# Altium schematic sheet 06.SchDoc
size 420 x 297 mm
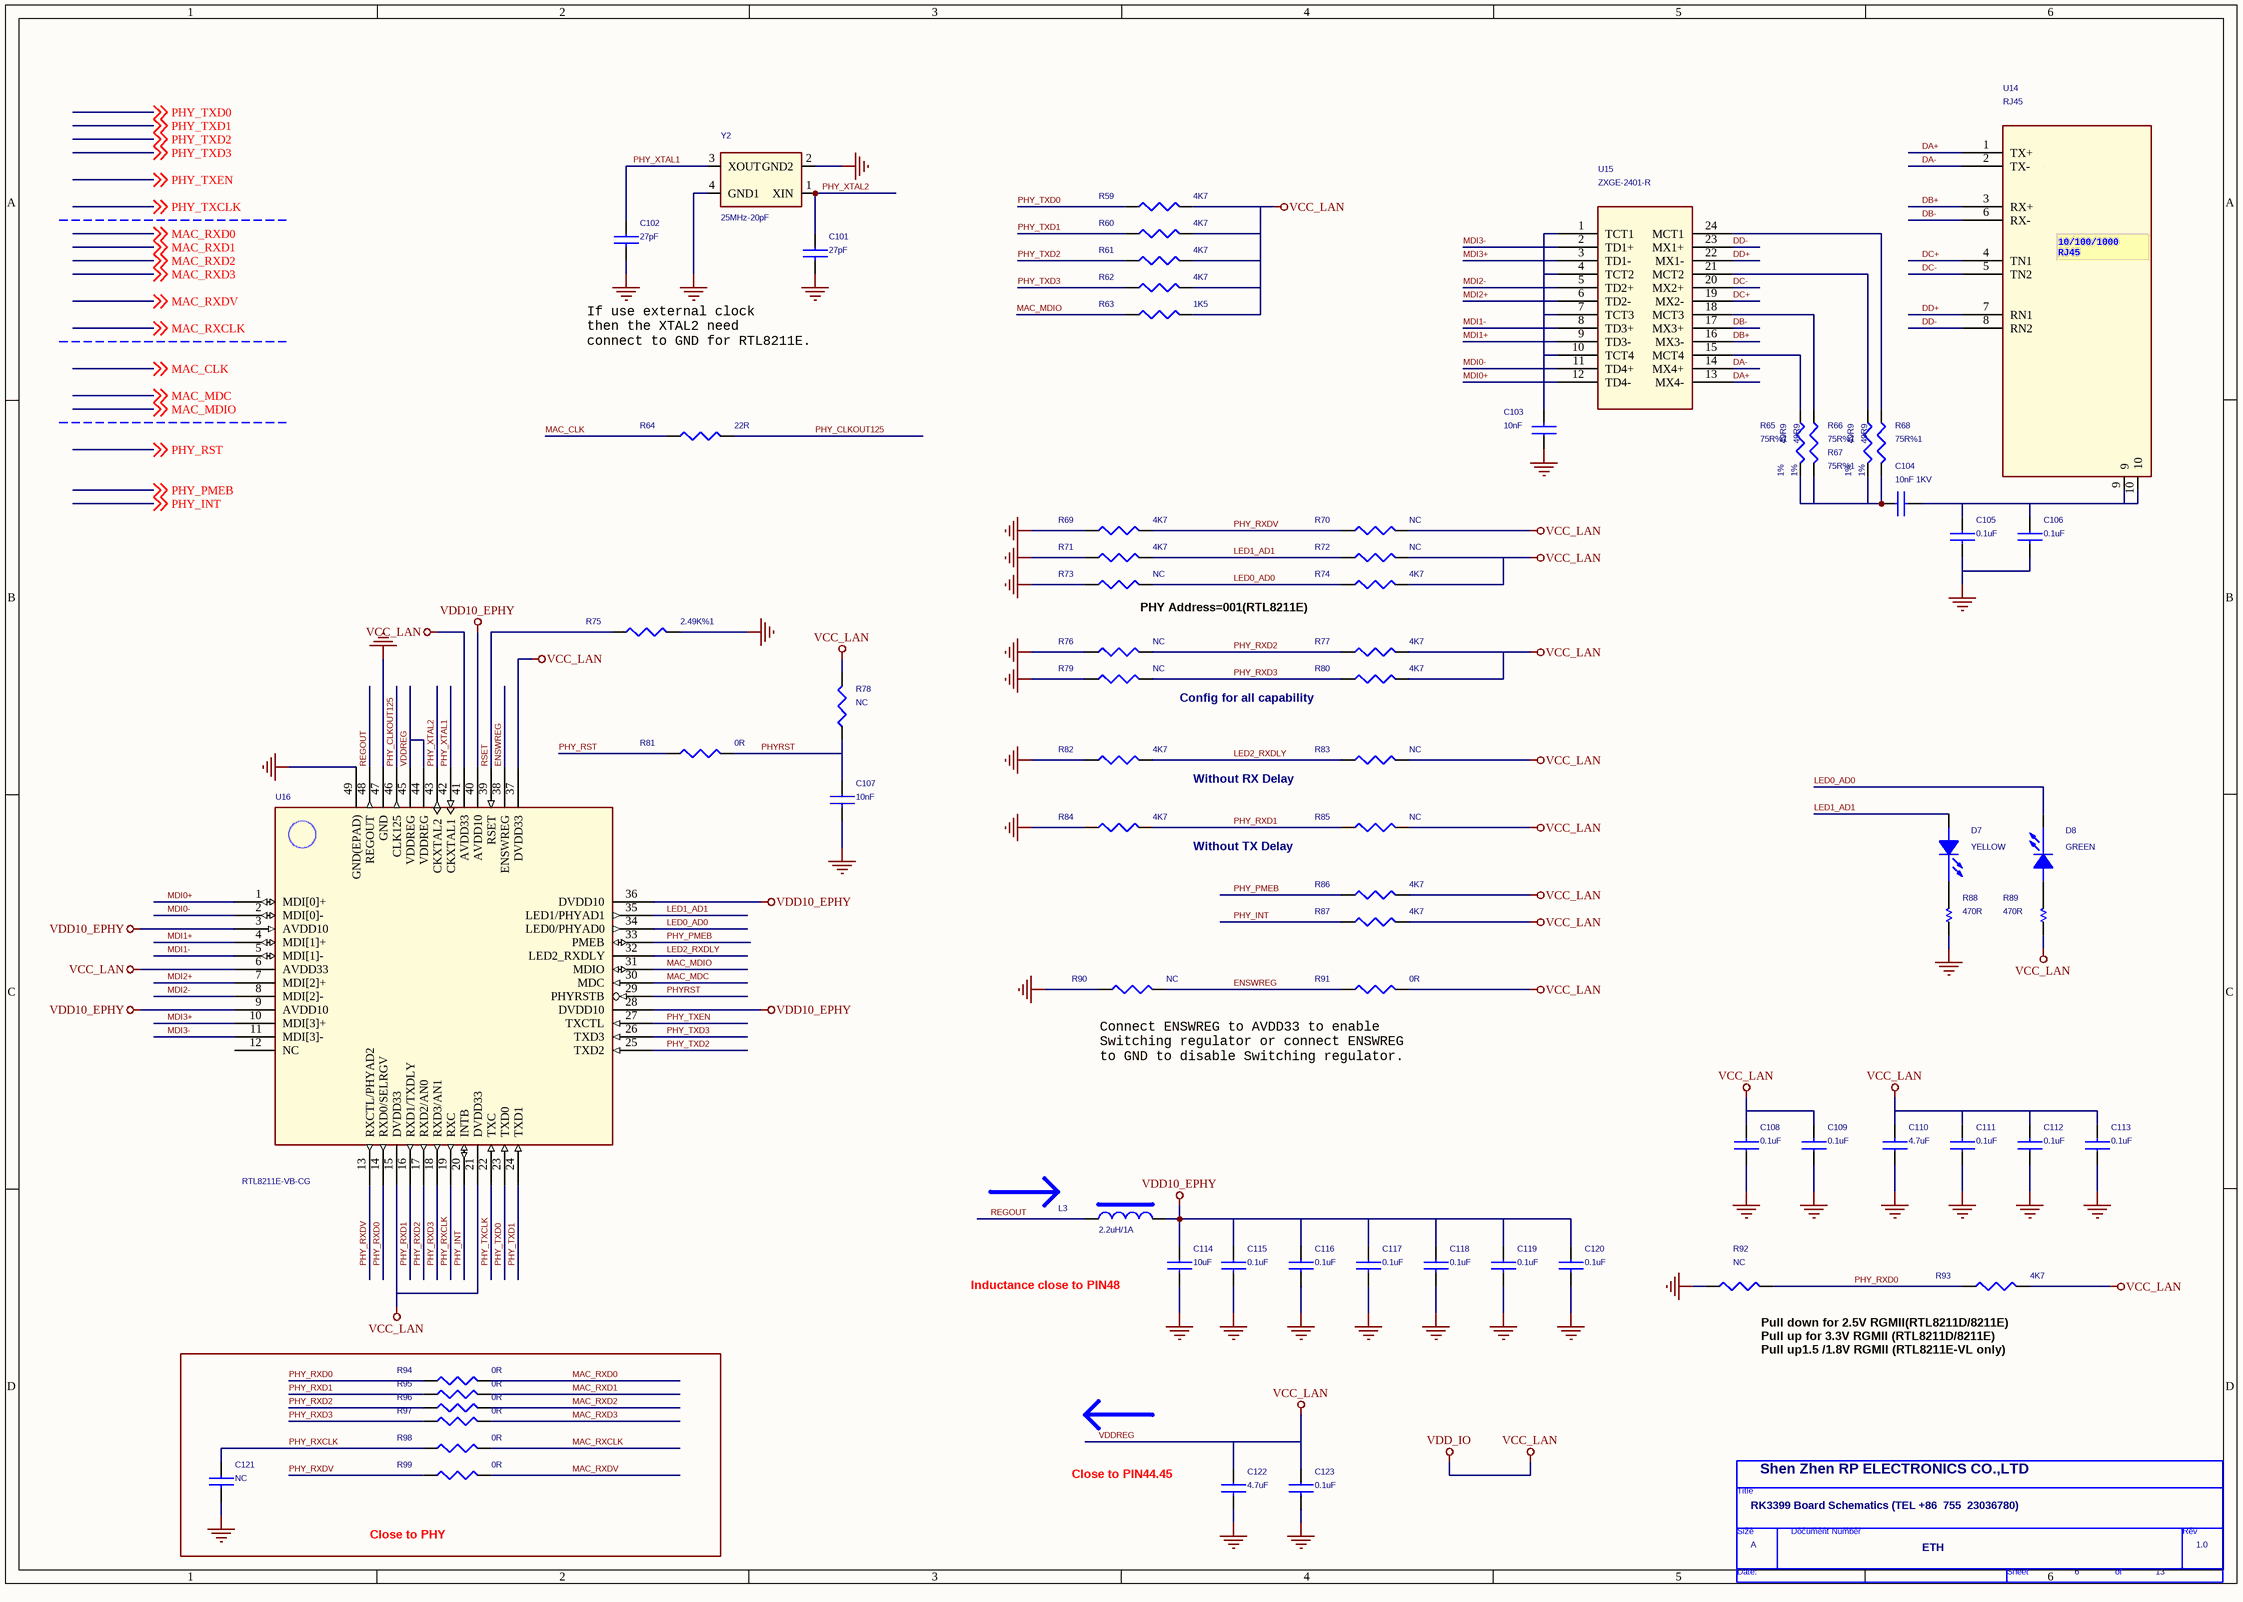
[diagram p0: 06.SchDoc]

## Parts
*  Doc: ETH  RevCode: 1.0  Title: RK3399 Board Schematics (TEL +86  755  23036780)  Page Size: A  Page Number: 6  Page Count: 13  Cage Code: Shen Zhen RP ELECTRONICS CO.,LTD  (hidden comment: TitleBlock0)  (graphical)
C101  27pF  [0402_cc]
C102  27pF  [0402_cc]
C103  10nF  [0402_cc]
C104  10nF 1KV  [C1206]
C105  0.1uF  [0402_cc]
C106  0.1uF  [0402_cc]
C107  10nF  [0402_cc]
C108  0.1uF  [0402_cc]
C109  0.1uF  [0402_cc]
C110  4.7uF  [0402_cc]
C111  0.1uF  [0402_cc]
C112  0.1uF  [0402_cc]
C113  0.1uF  [0402_cc]
C114  10uF  [0603_cc]
C115  0.1uF  [0402_cc]
C116  0.1uF  [0402_cc]
C117  0.1uF  [0402_cc]
C118  0.1uF  [0402_cc]
C119  0.1uF  [0402_cc]
C120  0.1uF  [0402_cc]
C121  NC  [0402_cc]
C122  4.7uF  [0402_cc]
C123  0.1uF  [0402_cc]
D7  YELLOW  [LED0805]
D8  GREEN  [LED0805]
L3  2.2uH/1A  [IND2520]
R59  4K7  [R0402]
R60  4K7  [R0402]
R61  4K7  [R0402]
R62  4K7  [R0402]
R63  1K5  [R0402]
R64  22R  [R0402]
R65  75R%1  TOL: 1%  VAL: 49R9  [R0805]
R66  75R%1  TOL: 1%  VAL: 49R9  [R0805]
R67  75R%1  TOL: 1%  VAL: 49R9  [R0805]
R68  75R%1  TOL: 1%  VAL: 49R9  [R0805]
R69  4K7  [R0402]
R70  NC  [R0402]
R71  4K7  [R0402]
R72  NC  [R0402]
R73  NC  [R0402]
R74  4K7  [R0402]
R75  2.49K%1  [R0402]
R76  NC  [R0402]
R77  4K7  [R0402]
R78  NC  [0603R]
R79  NC  [R0402]
R80  4K7  [R0402]
R81  0R  [R0402]
R82  4K7  [R0402]
R83  NC  [R0402]
R84  4K7  [R0402]
R85  NC  [R0402]
R86  4K7  [R0402]
R87  4K7  [R0402]
R88  470R  [0402_cc]
R89  470R  [0402_cc]
R90  NC  [R0402]
R91  0R  [R0402]
R92  NC  [R0402]
R93  4K7  [R0402]
R94  0R  [R0402]
R95  0R  [R0402]
R96  0R  [R0402]
R97  0R  [R0402]
R98  0R  [R0402]
R99  0R  [R0402]
U14  RJ45  [RJ45-881-810]
U15  ZXGE-2401-R  [ZXGE-2401-R]
U16  RTL8211E-VB-CG  [QFN48-6X6]
Y2  25MHz-20pF  [CRY-3225]

## Blocks framed on the sheet
Close to PHY: C121 R94-R99

## Nets
GND: C101.2 C102.2 C103.1 C105.2 C106.2 C107.2 C108.1 C109.1 C110.1 C111.1 C112.1 C113.1 C114.2 C115.2 C116.2 C117.2 C118.2 C119.2 C120.2 C121.2 C122.2 C123.2 R69.1 R71.1 R73.1 R75.2 R76.1 R79.1 R82.1 R84.1 R88.1 R90.1 R92.1 U16.47(GND) U16.49(GND(EPAD)) Y2.2(GND2) Y2.4(GND1)
VDD10_EPHY: C114.1 C115.1 C116.1 C117.1 C118.1 C119.1 C120.1 L3.2 U16.3(AVDD10) U16.9(AVDD10) U16.28(DVDD10) U16.36(DVDD10) U16.40(AVDD10)
VDDREG: C108.2 C109.2 C110.2 C111.2 C112.2 C113.2 C122.1 C123.1 R59.2 R60.2 R61.2 R62.2 R63.2 R70.2 R72.2 R74.2 R77.2 R78.2 R80.2 R83.2 R85.2 R86.2 R87.2 R89.1 R91.2 R93.2 U16.6(AVDD33) U16.15(DVDD33) U16.21(DVDD33) U16.37(DVDD33) U16.41(AVDD33) U16.44(VDDREG) U16.45(VDDREG)  [also labelled VCC_LAN, VDD_IO]
DA+: U14.1(TX+) U15.13(MX4-)
DA-: U14.2(TX-) U15.14(MX4+)
DB+: U14.3(RX+) U15.16(MX3-)
DB-: U14.6(RX-) U15.17(MX3+)
DC+: U14.4(TN1) U15.19(MX2-)
DC-: U14.5(TN2) U15.20(MX2+)
DD+: U14.7(RN1) U15.22(MX1-)
DD-: U14.8(RN2) U15.23(MX1+)
ENSWREG: R90.2 R91.1 U16.38(ENSWREG)
LED0_AD0: D8.2(CATHODE) R73.2 R74.1 U16.34(LED0/PHYAD0)
LED1_AD1: D7.1(ANODE) R71.2 R72.1 U16.35(LED1/PHYAD1)
LED2_RXDLY: R82.2 R83.1 U16.32(LED2_RXDLY)
MAC_CLK: R64.1 ; off-sheet MAC_CLK
MAC_MDC: U16.30(MDC) ; off-sheet MAC_MDC
MAC_MDIO: R63.1 U16.31(MDIO) ; off-sheet MAC_MDIO
MAC_RXCLK: R98.2 ; off-sheet MAC_RXCLK
MAC_RXD0: R94.2 ; off-sheet MAC_RXD0
MAC_RXD1: R95.2 ; off-sheet MAC_RXD1
MAC_RXD2: R96.2 ; off-sheet MAC_RXD2
MAC_RXD3: R97.2 ; off-sheet MAC_RXD3
MAC_RXDV: R99.2 ; off-sheet MAC_RXDV
MDI0+: U15.12(TD4-) U16.1(MDI[0]+)
MDI0-: U15.11(TD4+) U16.2(MDI[0]-)
MDI1+: U15.9(TD3-) U16.4(MDI[1]+)
MDI1-: U15.8(TD3+) U16.5(MDI[1]-)
MDI2+: U15.6(TD2-) U16.7(MDI[2]+)
MDI2-: U15.5(TD2+) U16.8(MDI[2]-)
MDI3+: U15.3(TD1-) U16.10(MDI[3]+)
MDI3-: U15.2(TD1+) U16.11(MDI[3]-)
PHY_CLKOUT125: R64.2 U16.46(CLK125)
PHY_INT: R87.1 U16.20(INTB) ; off-sheet PHY_INT
PHY_PMEB: R86.1 U16.33(PMEB) ; off-sheet PHY_PMEB
PHY_RST: R81.1 ; off-sheet PHY_RST
PHY_RXCLK: C121.1 R98.1 U16.19(RXC)
PHY_RXD0: R92.2 R93.1 R94.1 U16.14(RXD0/SELRGV)
PHY_RXD1: R84.2 R85.1 R95.1 U16.16(RXD1/TXDLY)
PHY_RXD2: R76.2 R77.1 R96.1 U16.17(RXD2/AN0)
PHY_RXD3: R79.2 R80.1 R97.1 U16.18(RXD3/AN1)
PHY_RXDV: R69.2 R70.1 R99.1 U16.13(RXCTL/PHYAD2)
PHY_TXCLK: U16.22(TXC) ; off-sheet PHY_TXCLK
PHY_TXD0: R59.1 U16.23(TXD0) ; off-sheet PHY_TXD0
PHY_TXD1: R60.1 U16.24(TXD1) ; off-sheet PHY_TXD1
PHY_TXD2: R61.1 U16.25(TXD2) ; off-sheet PHY_TXD2
PHY_TXD3: R62.1 U16.26(TXD3) ; off-sheet PHY_TXD3
PHY_TXEN: U16.27(TXCTL) ; off-sheet PHY_TXEN
PHY_XTAL1: C102.1 U16.42(CKXTAL1) Y2.3(XOUT)
PHY_XTAL2: C101.1 U16.43(CKXTAL2) Y2.1(XIN)
PHYRST: C107.1 R78.1 R81.2 U16.29(PHYRSTB)
REGOUT: L3.1 U16.48(REGOUT)
RSET: R75.1 U16.39(RSET)
NetC103_2: C103.2 U15.1(TCT1) U15.4(TCT2) U15.7(TCT3) U15.10(TCT4)
NetC104_1: C104.1 R65.2(R2) R66.2(R2) R67.2(R2) R68.2(R2)
NetC104_2: C104.2 C105.1 C106.1 U14.9 U14.10
NetD7_2: D7.2(CATHODE) R88.2
NetD8_1: D8.1(ANODE) R89.2
NetR65_1: R65.1(R1) U15.15(MCT4)
NetR66_1: R66.1(R1) U15.18(MCT3)
NetR67_1: R67.1(R1) U15.21(MCT2)
NetR68_1: R68.1(R1) U15.24(MCT1)

Not connected (* = marked no-connect by the designer): U16 12(NC)

## Notes on the sheet
- If use external clock
  then the XTAL2 need
  connect to GND for RTL8211E.
- PHY Address=001(RTL8211E)
- Config for all capability
- Without RX Delay
- Without TX Delay
- Connect ENSWREG to AVDD33 to enable
  Switching regulator or connect ENSWREG
  to GND to disable Switching regulator.
- Inductance close to PIN48
- Pull down for 2.5V RGMII(RTL8211D/8211E)
  Pull up for 3.3V RGMII (RTL8211D/8211E)
  Pull up1.5 /1.8V RGMII (RTL8211E-VL only)
- Close to PIN44.45
- (in symbol HFJ11-1G01E_3) 10/100/1000 / RJ45
- (in symbol TitleBlock0) Title; Size; Document Number; Rev; Date:; Sheet; of

## Library data of the parts
C101 C102 C107 C114-C123 = CAP NP_0
C103 C108 C109 C111-C113 = CAP NP_2_Dup1: ROOM: CHG
C104 = CAP NP_2: 贴片电容
C105 C106 = CAP NP_Dup3: 贴片电容
C110 = CAP NP_4_Dup1
D7 D8 = LED
L3 = INDUCTOR_1_Dup1: CoilInd,Shielded(SHLD),2.2uH@100KHz,+/-30%,1.09A,110mOhm,SMD,3.0*3.0*1.0; ROOM: USB+5V
R59-R64 R69-R77 R79-R87 R90-R99 = RESISTOR_Dup2: RES,thick film,33Ohm,+/-5%,1/16W,SMD0402
R65-R68 = 49R9-0805: PUI: 0.125; FAB: PHILIPS; BOI: 0805; DESIG: RC11; REF: 2322-734-64998; DEV: R0805
R78 = R5_0.1K_0603
R88 R89 = SMALL R1
U14 = HFJ11-1G01E_3
U15 = H5007_2
U16 = RTL8169s_1
Y2 = CRYSTAL-4_2: Crystal,37.400MHz,+/-20ppm,12pF,SMD3225,-10°C ~ +60   °C
* = TitleBlock0: Page Create Date: March  8, 1995